# EAGLE design GBCZ (EAGLE 8.6.3)
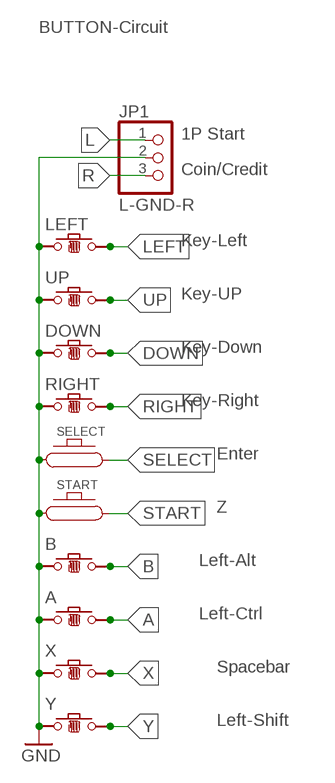
[diagram p0: schematic, sheet 1]

## Parts
A  GBC_BTN  [GBC_BTN]
B  GBC_BTN  [GBC_BTN]
DOWN  GBC_BTN  [GBC_BTN]
JP1  L-GND-R  PINHD-1X3  [1X03]
LEFT  GBC_BTN  [GBC_BTN]
RIGHT  GBC_BTN  [GBC_BTN]
SELECT  GBC_BTN_START  [GBC_BTN_START]
START  GBC_BTN_START  [GBC_BTN_START]
UP  GBC_BTN  [GBC_BTN]
X  GBC_BTN  [GBC_BTN]
Y  GBC_BTN  [GBC_BTN]

## Nets
A: A.P$2
B: B.P$2
DOWN: DOWN.P$2
GND: A.P$1 B.P$1 DOWN.P$1 JP1.2 LEFT.P$1 RIGHT.P$1 SELECT.P$1 START.P$1 UP.P$1 X.P$1 Y.P$1
L: JP1.1
LEFT: LEFT.P$2
R: JP1.3
RIGHT: RIGHT.P$2
SELECT: SELECT.P$2
START: START.P$2
UP: UP.P$2
X: X.P$2
Y: Y.P$2

## Notes on the sheet
- BUTTON-Circuit
- 1P Start
- Coin/Credit
- Key-Left
- Key-UP
- Key-Down
- Key-Right
- Enter
- Z
- Left-Alt
- Left-Ctrl
- Spacebar
- Left-Shift

## Library data of the parts
A B DOWN LEFT RIGHT UP X Y = GB Color:GBC_BTN
JP1 = pinhead:PINHD-1X3: PIN HEADER
SELECT START = GB Color:GBC_BTN_START: START and SELECT button for the Game Boy Color

## Board
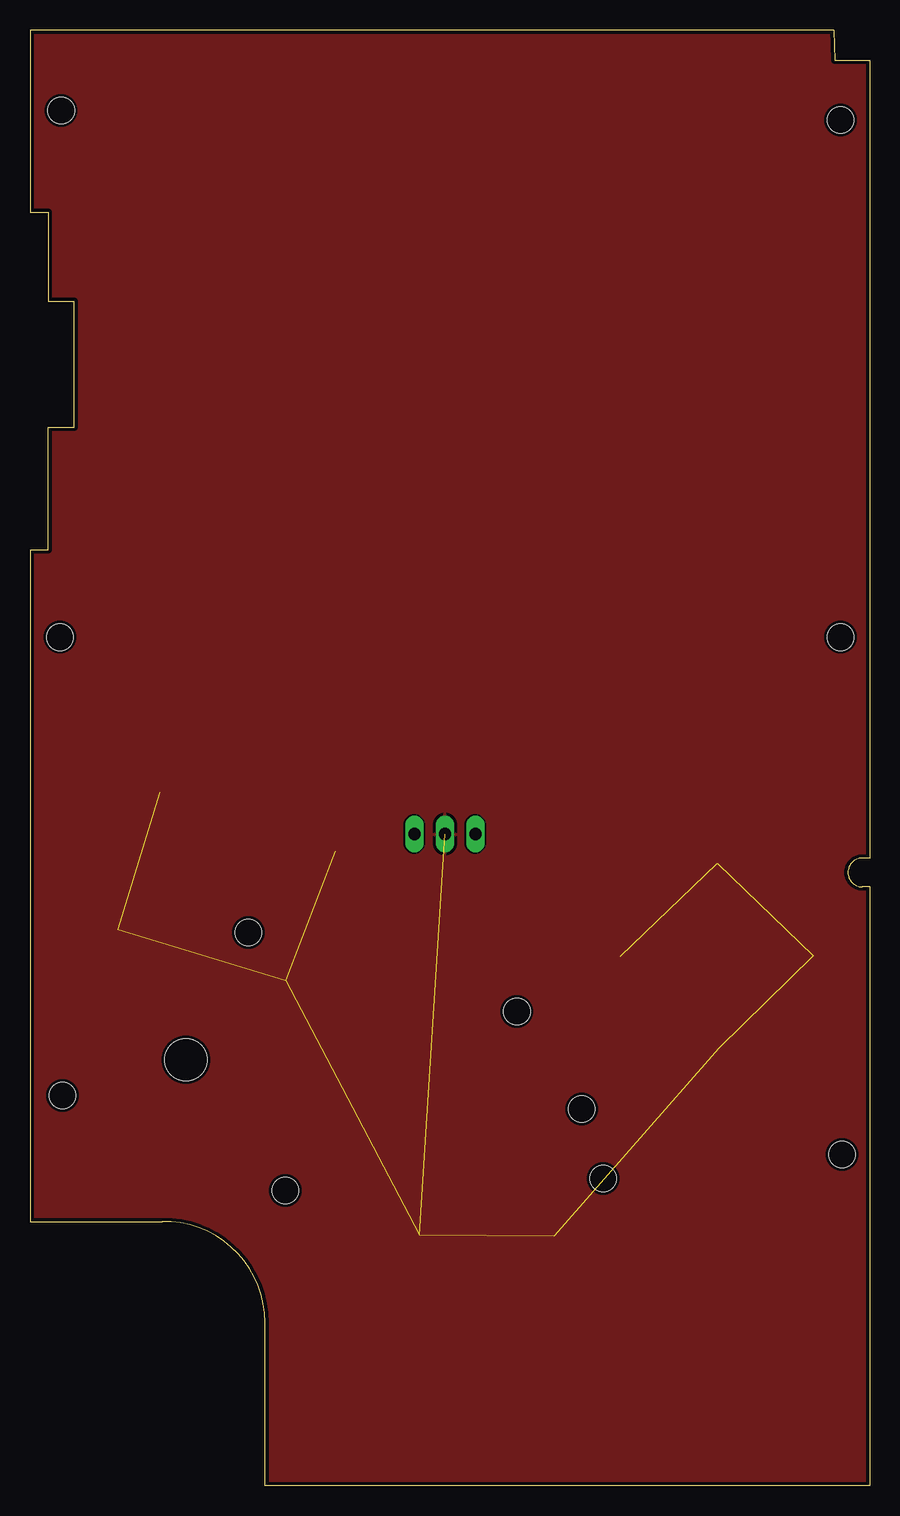
[diagram p1: board, top side]
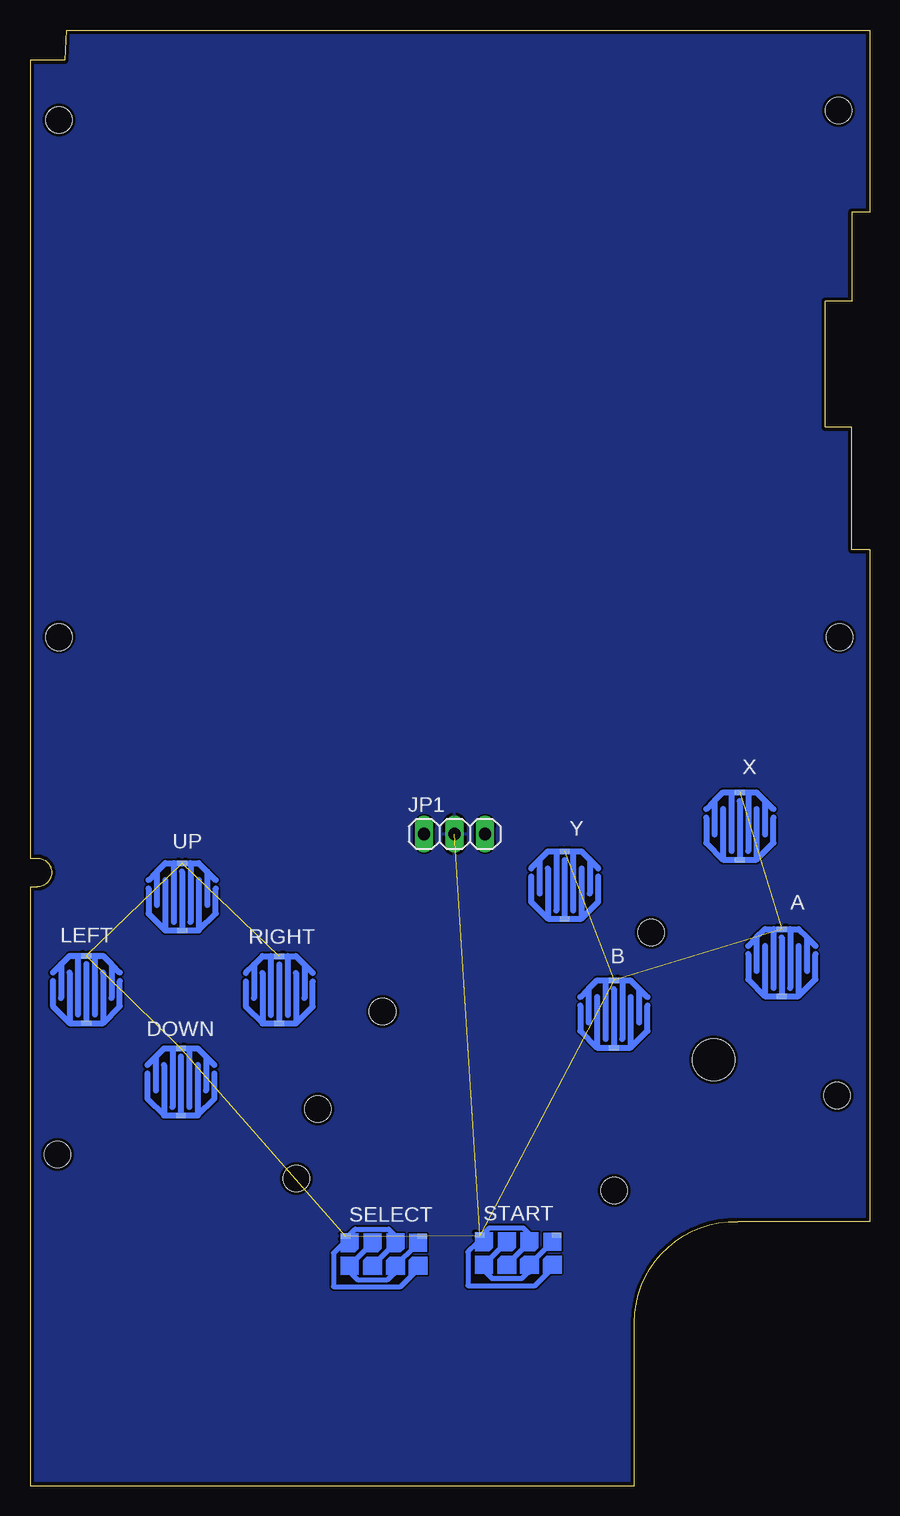
[diagram p2: board, bottom side, seen from below]

Size 70 x 121.3 mm. Coordinates in mm from the lower left corner, seen from the top.
Outline: 70,0 19.6,0 19.6,13.6 arc91 11,22 0,22 0,78 1.5,78 1.5,88.2 3.7,88.2 3.7,98.7 1.5,98.7 1.5,106.1 0,106.1 0,121.3 67,121.3 67.1,118.8 70,118.8 70,52.3 69.4,52.3 arc180 69.4,49.9 70,49.9 70,0
Copper layers (1*16): Top 0.035mm / dielectric 1.5mm / Bottom 0.035mm
Design rules "default *": minimum track width 6mil, minimum drill 0.35mm, track to track 6mil, track to pad 6mil, pad to pad 6mil, via to via 6mil, smd to smd 6mil, copper to edge 10mil, drill to drill 6mil, minimum pad ring 10mil, minimum via ring 8mil, stop-mask expansion 4mil, vias tented up to drill 0mil, thermal gap 10mil
Holes 2.2 mm at 2.6,114.6 67.6,113.8 2.5,70.7 67.6,70.7 18.2,46.1 2.7,32.5 40.6,39.5 46,31.4 21.3,24.6 47.8,25.6 67.7,27.6
Holes 3.5 mm at 13,35.5

### Footprints (pad centres in the part's own frame; a part is rotated, then mirrored left to right if it is on the bottom)
GBC_BTN = smd 0.813 x 0.406: P$1 -0.01,2.79; P$2 -0.01,-2.81
1X03 = drill 1.016 long: 1 -2.54,0; 2 0,0; 3 2.54,0
GBC_BTN_START = smd 0.813 x 0.406: P$1 -3.3,1.4; P$2 3.1,1.4

### Placement (x,y rotation side)
A  7.31,43.59 0 bottom
B  21.31,39.31 0 bottom
DOWN  57.41,33.65 0 bottom
JP1  34.6,54.3 0 bottom
LEFT  65.29,41.36 0 bottom
RIGHT  49.21,41.33 0 bottom
SELECT  40.39,19.37 0 bottom
START  29.19,19.47 0 bottom
UP  57.31,49.07 0 bottom
X  10.81,54.97 0 bottom
Y  25.41,50.05 0 bottom

### Tracks (layer width: path | path; a pad name or v marks a point on that pad's centre or on a via)
GND  (10 unrouted)
  pour Top: -5.3,128.5 77.1,128.7 77.3,-7 -2.5,-6.8 -2.7,128.5
  pour Bottom: -5.3,130.3 -5.9,-11.2 80.6,-11.2 79.8,130.6